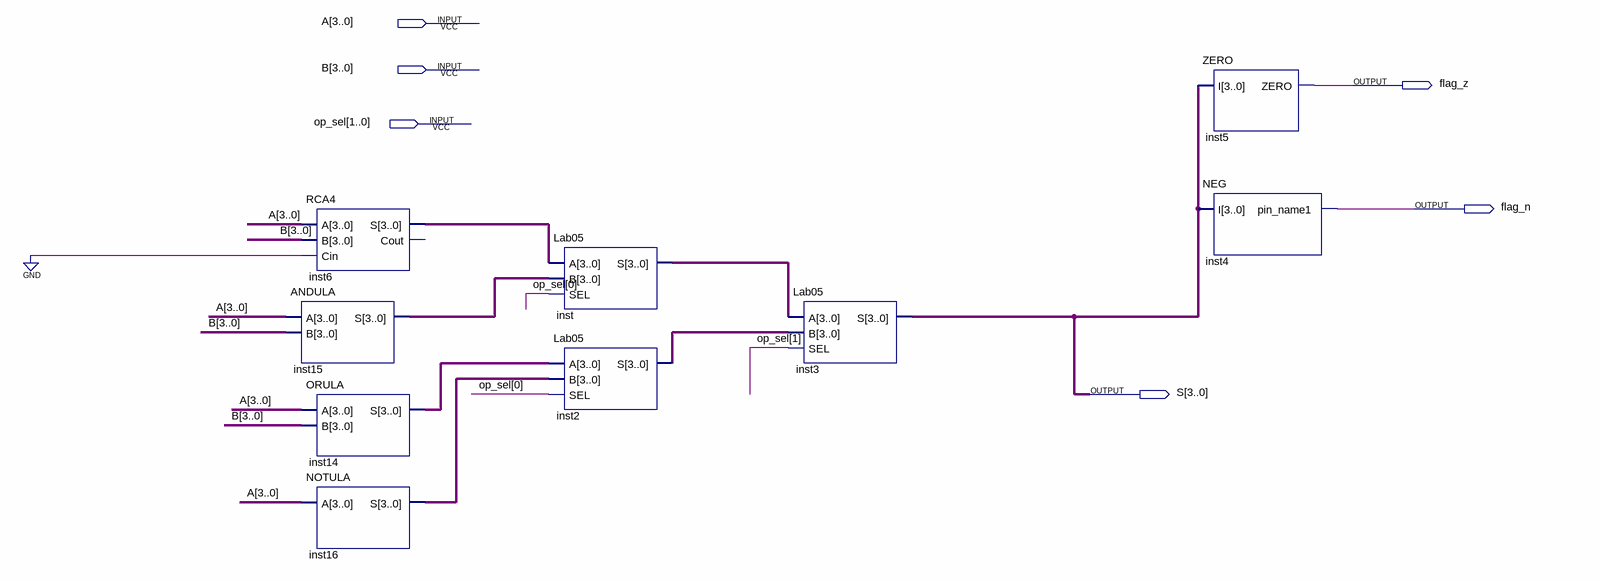
[diagram p0: schematic sheet]
// Quartus schematic ULA.bdf as structural Verilog: 9 symbols, 6 pins
module ULA (
  input  [3:0] A,
  input  [3:0] B,
  input  [1:0] op_sel,
  output flag_z,
  output flag_n,
  output [3:0] S
);

  wire [3:0] inst2_s, inst6_s, inst14_s, inst15_s, inst16_s, inst_s;

  RCA4 inst6 (.A(A), .B(B), .Cin(1'b0), .S(inst6_s));  // open: Cout
  ANDULA inst15 (.A(A), .B(B), .S(inst15_s));
  ORULA inst14 (.A(A), .B(B), .S(inst14_s));
  NOTULA inst16 (.A(A), .S(inst16_s));
  Lab05 inst (.A(inst6_s), .B(inst15_s), .SEL(op_sel[0]), .S(inst_s));
  Lab05 inst2 (.A(inst14_s), .B(inst16_s), .SEL(op_sel[0]), .S(inst2_s));
  Lab05 inst3 (.A(inst_s), .B(inst2_s), .SEL(op_sel[1]), .S(S));
  ZERO inst5 (.I(S), .ZERO(flag_z));
  NEG inst4 (.I(S), .pin_name1(flag_n));
endmodule
